# EasyEDA Pro project ProPrj_Project_PRISM_2026-03-07.epro, schematic PRISM RP2040

## Sheets
1 P1: Assembly Variant: Basic; Board Name: Board1; Create Date: 2026-01-16; Page Name: P1; Project Name: Project_PRISM; Schematic Name: Schematic1; Update Date: 2026-01-16; BladeWidth: 10; Page Size: A4; RegionStart: 1; ShowBorder: 1; TitleBlock: 1; TitleBlockPosition: 3; Version: 0; XRegionCount: 6; YRegionCount: 4
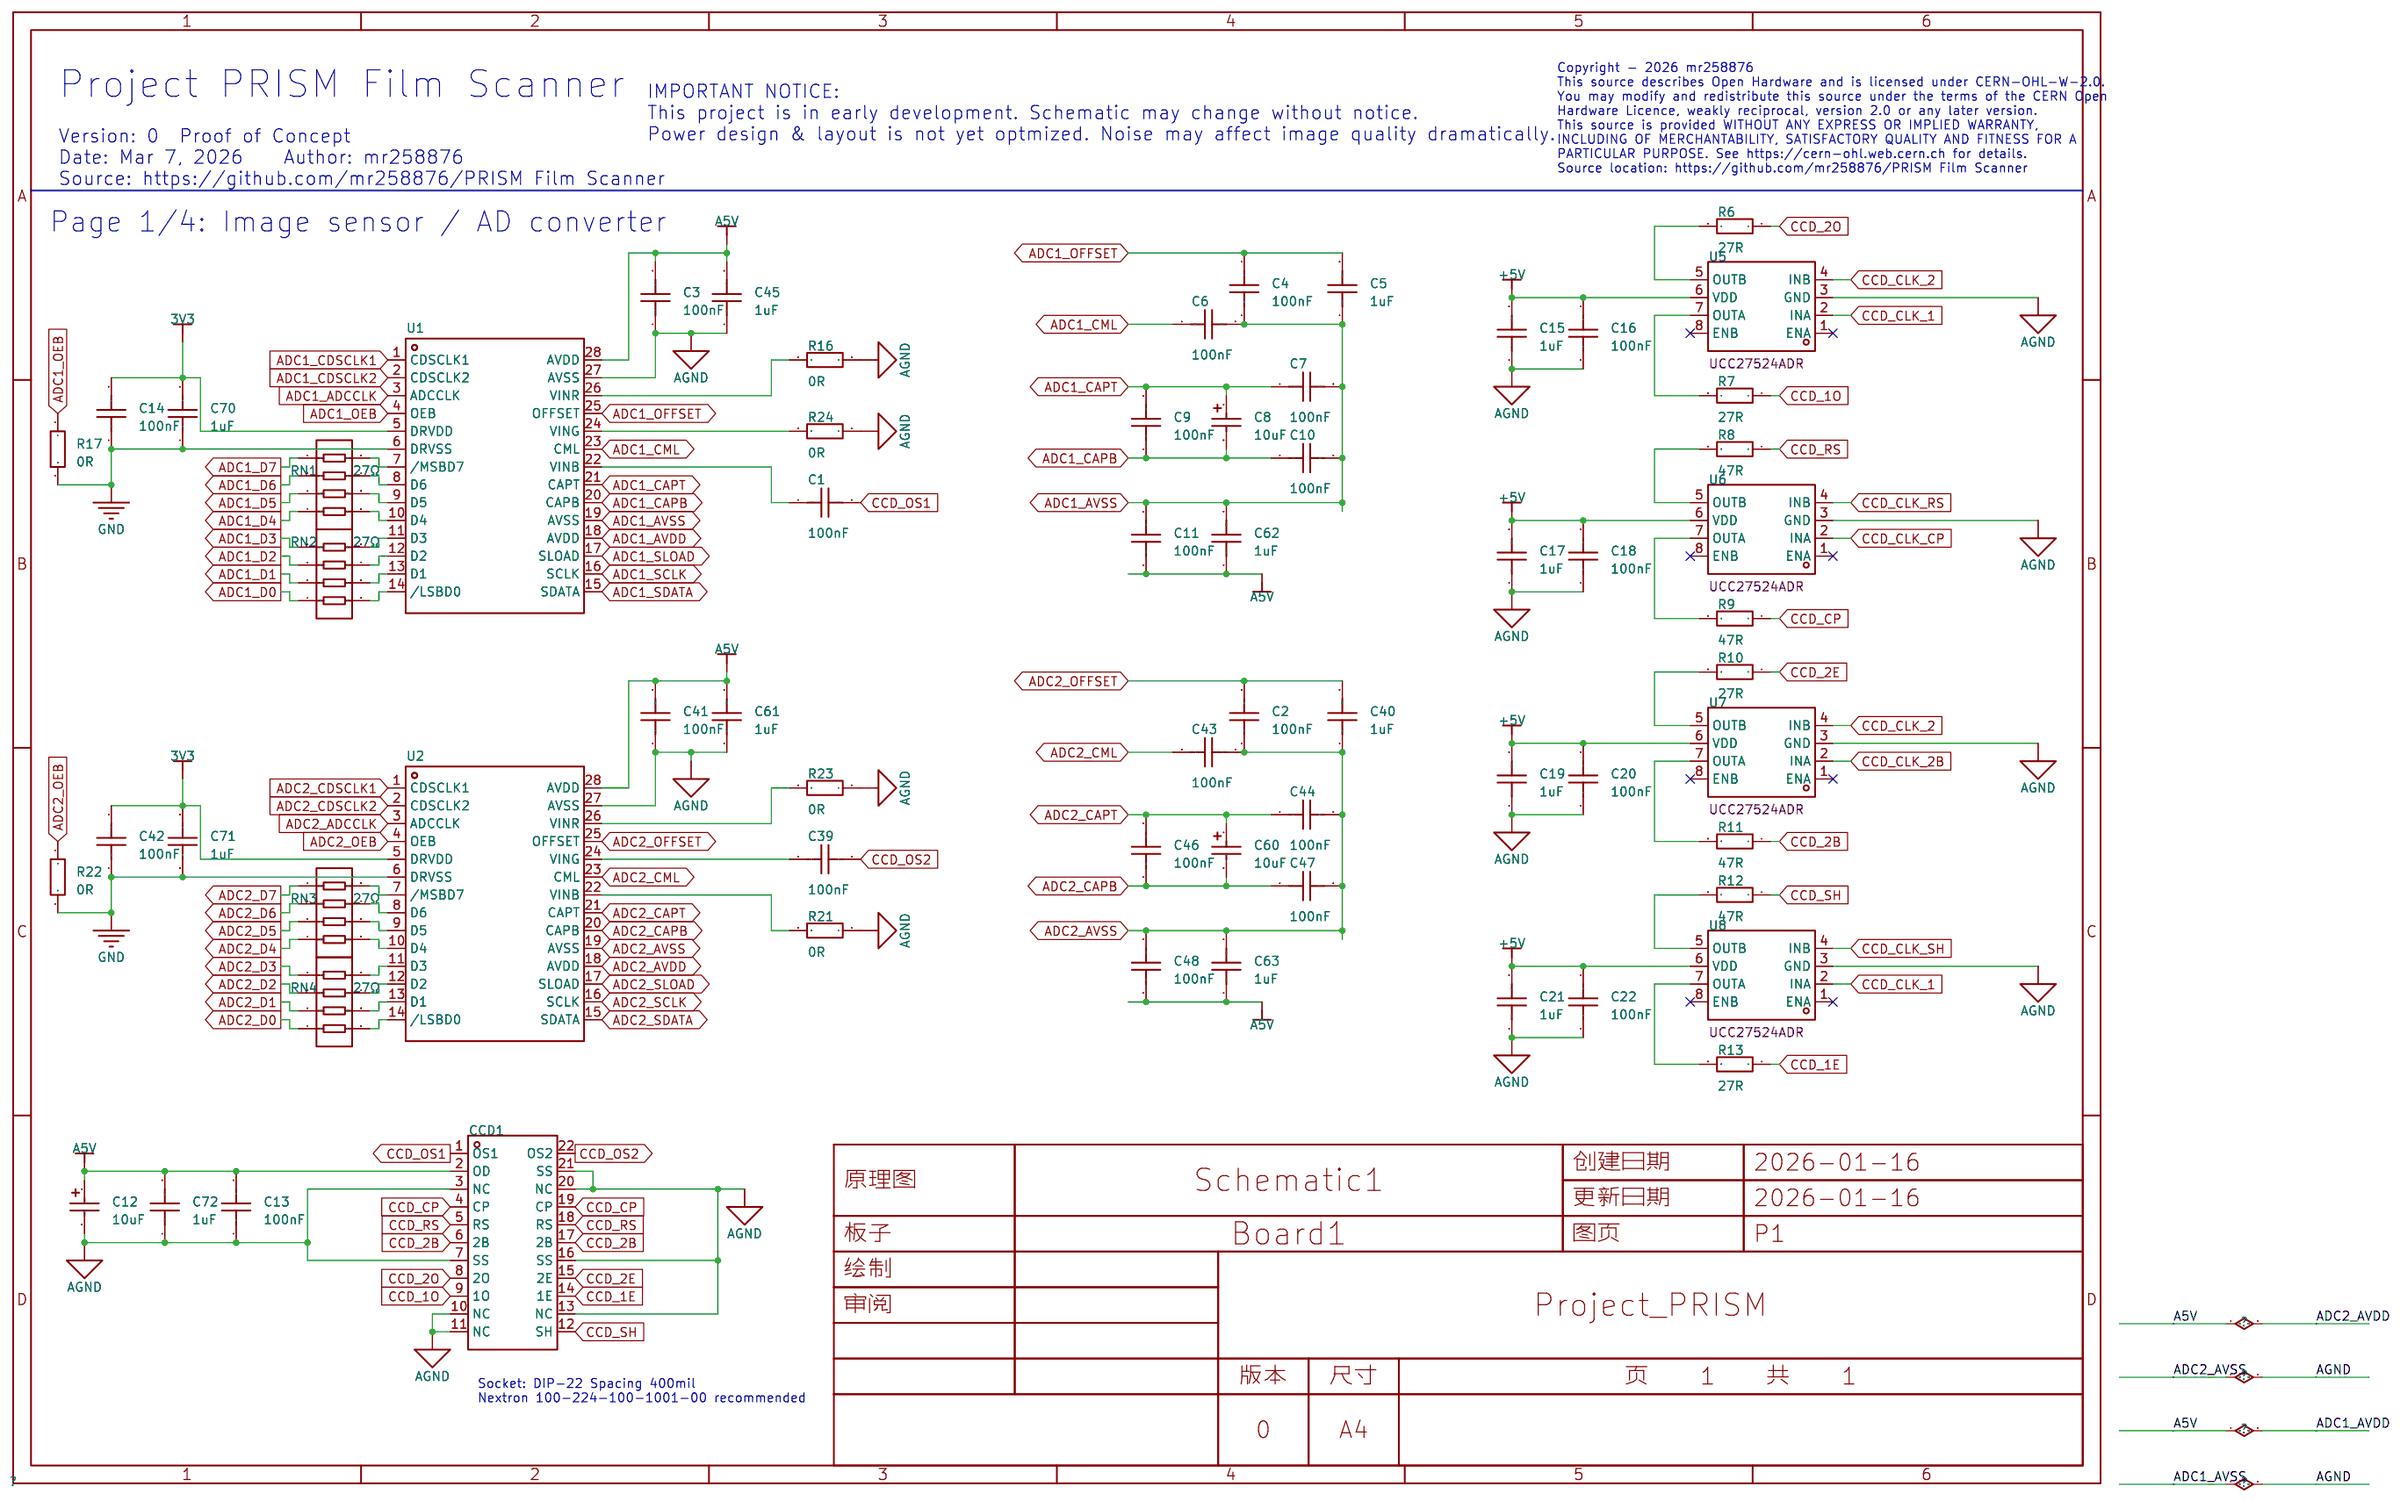
[diagram p0: P1]
2 P2: Page Name: P2
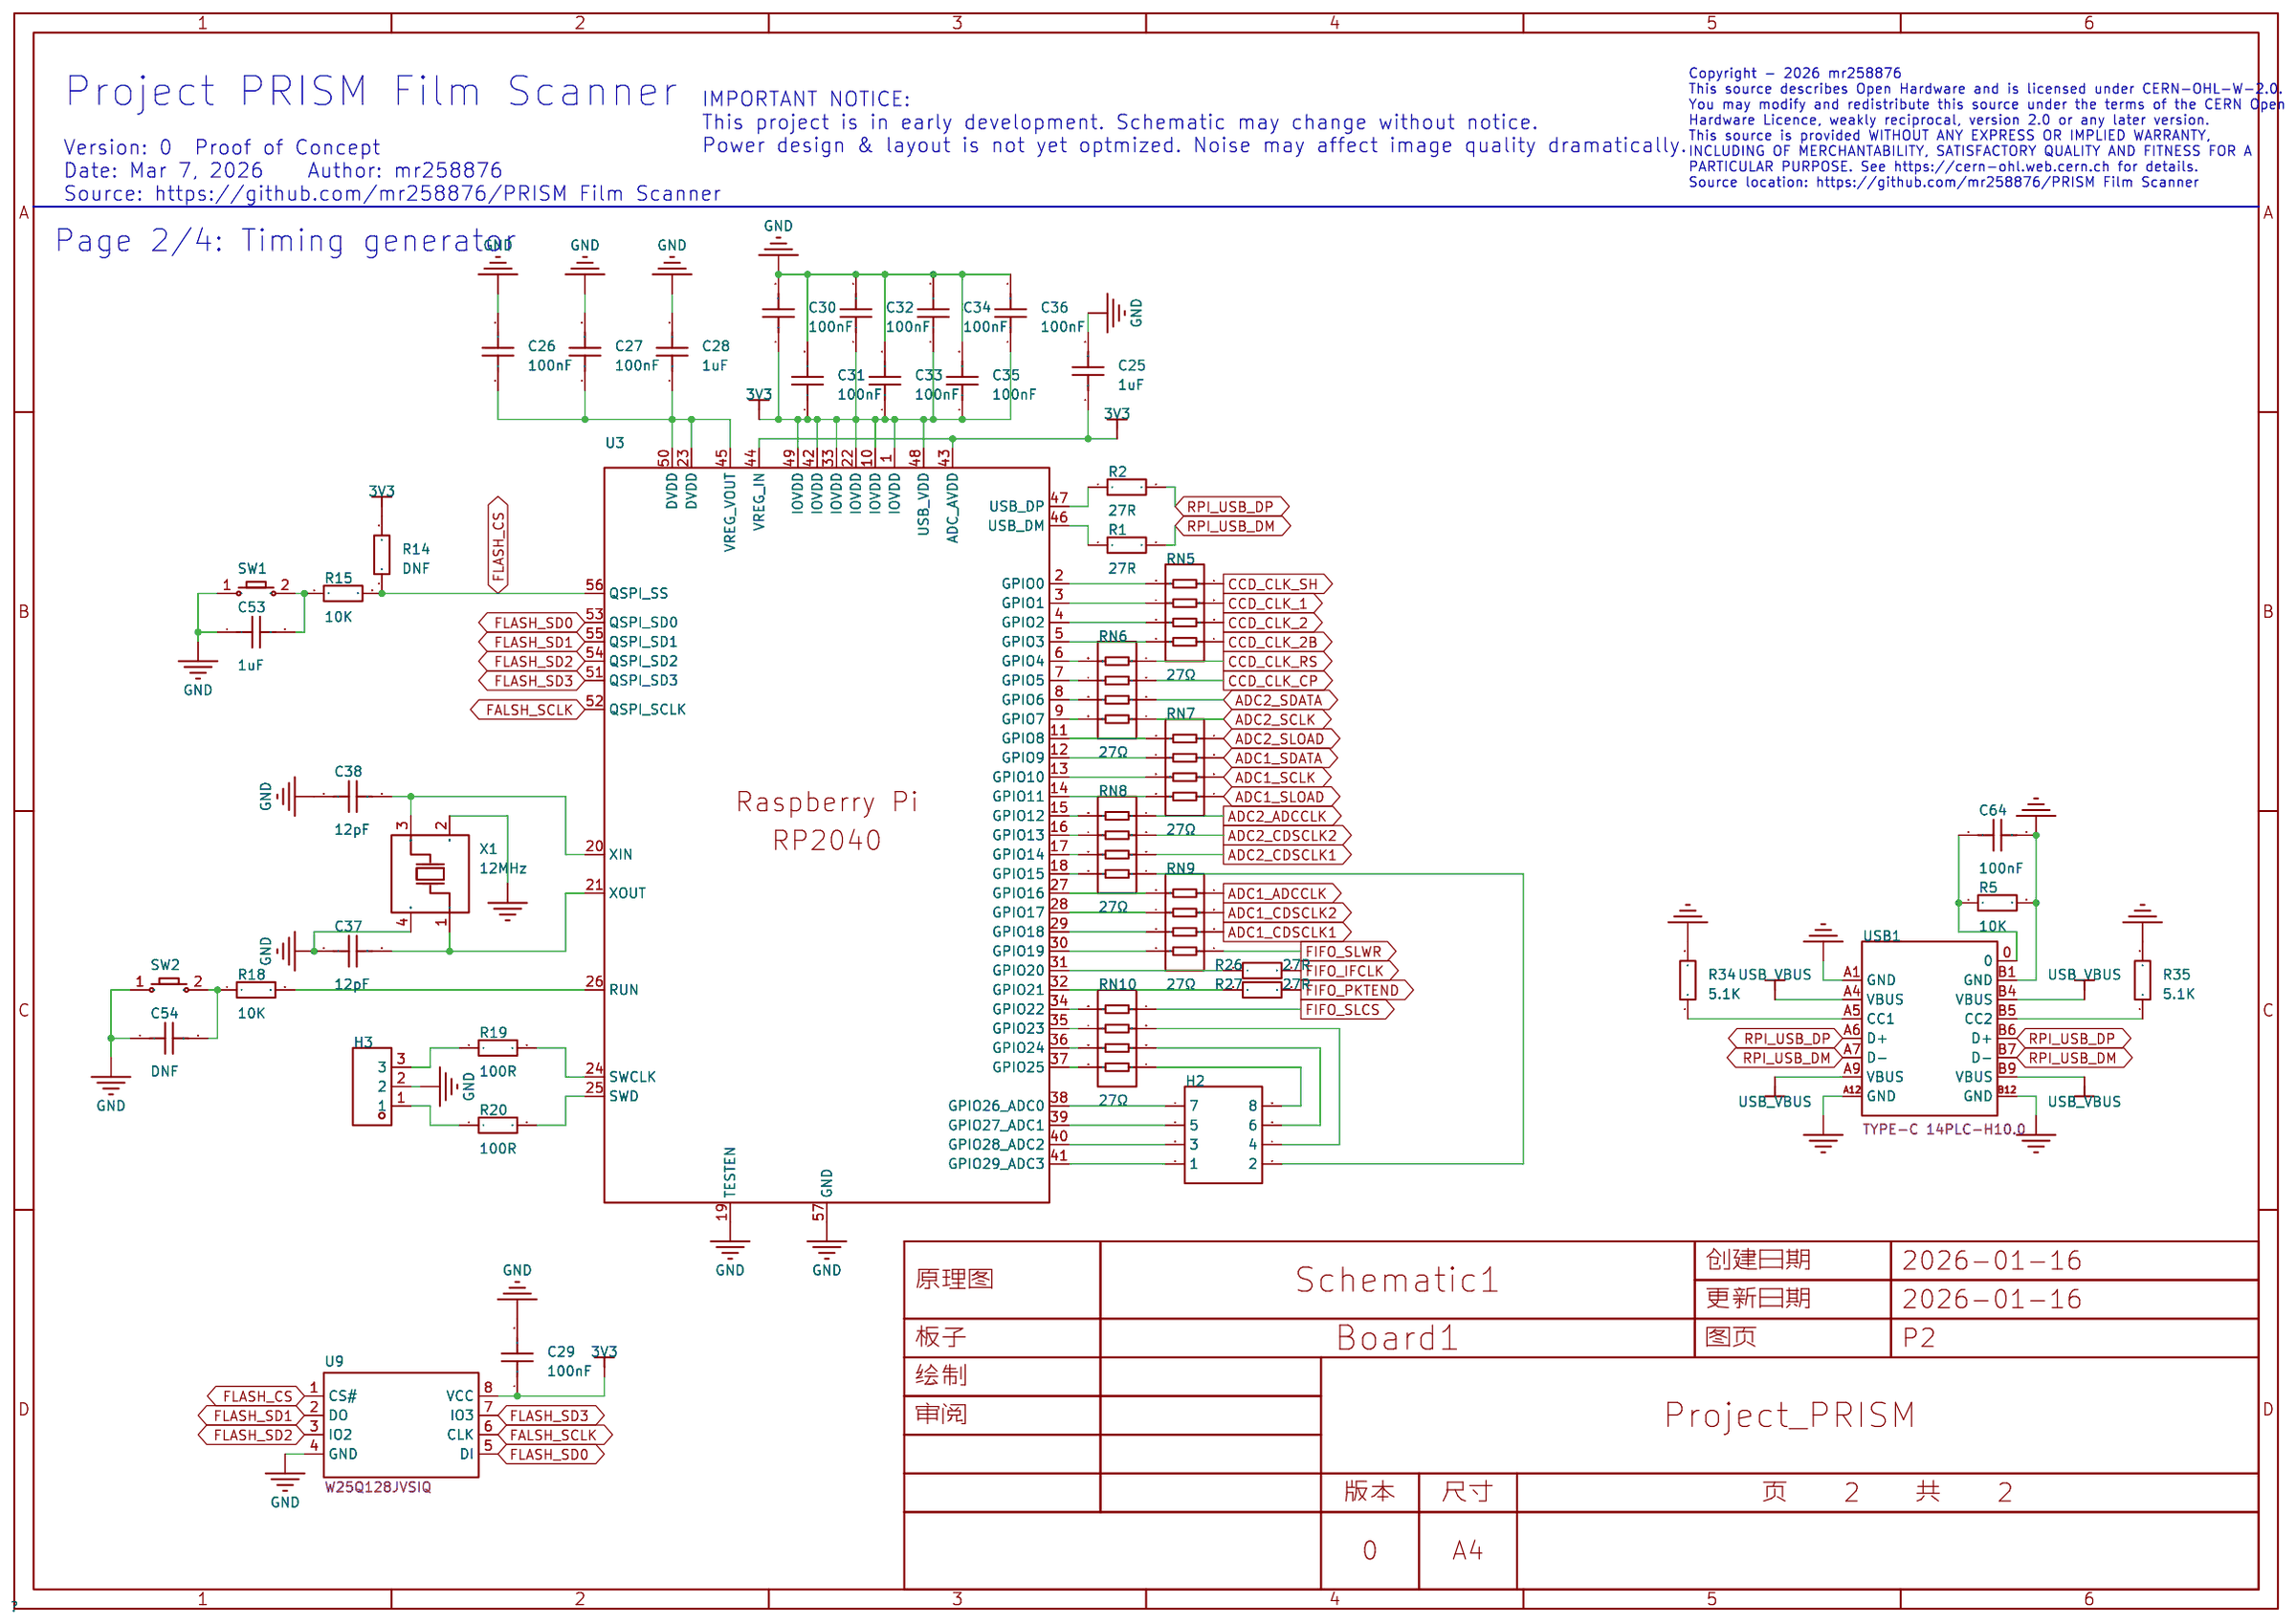
[diagram p1: P2]
3 P3: Board Name: PRISM RP2040; Create Date: 2026-01-30; Page Name: P3; Update Date: 2026-01-30
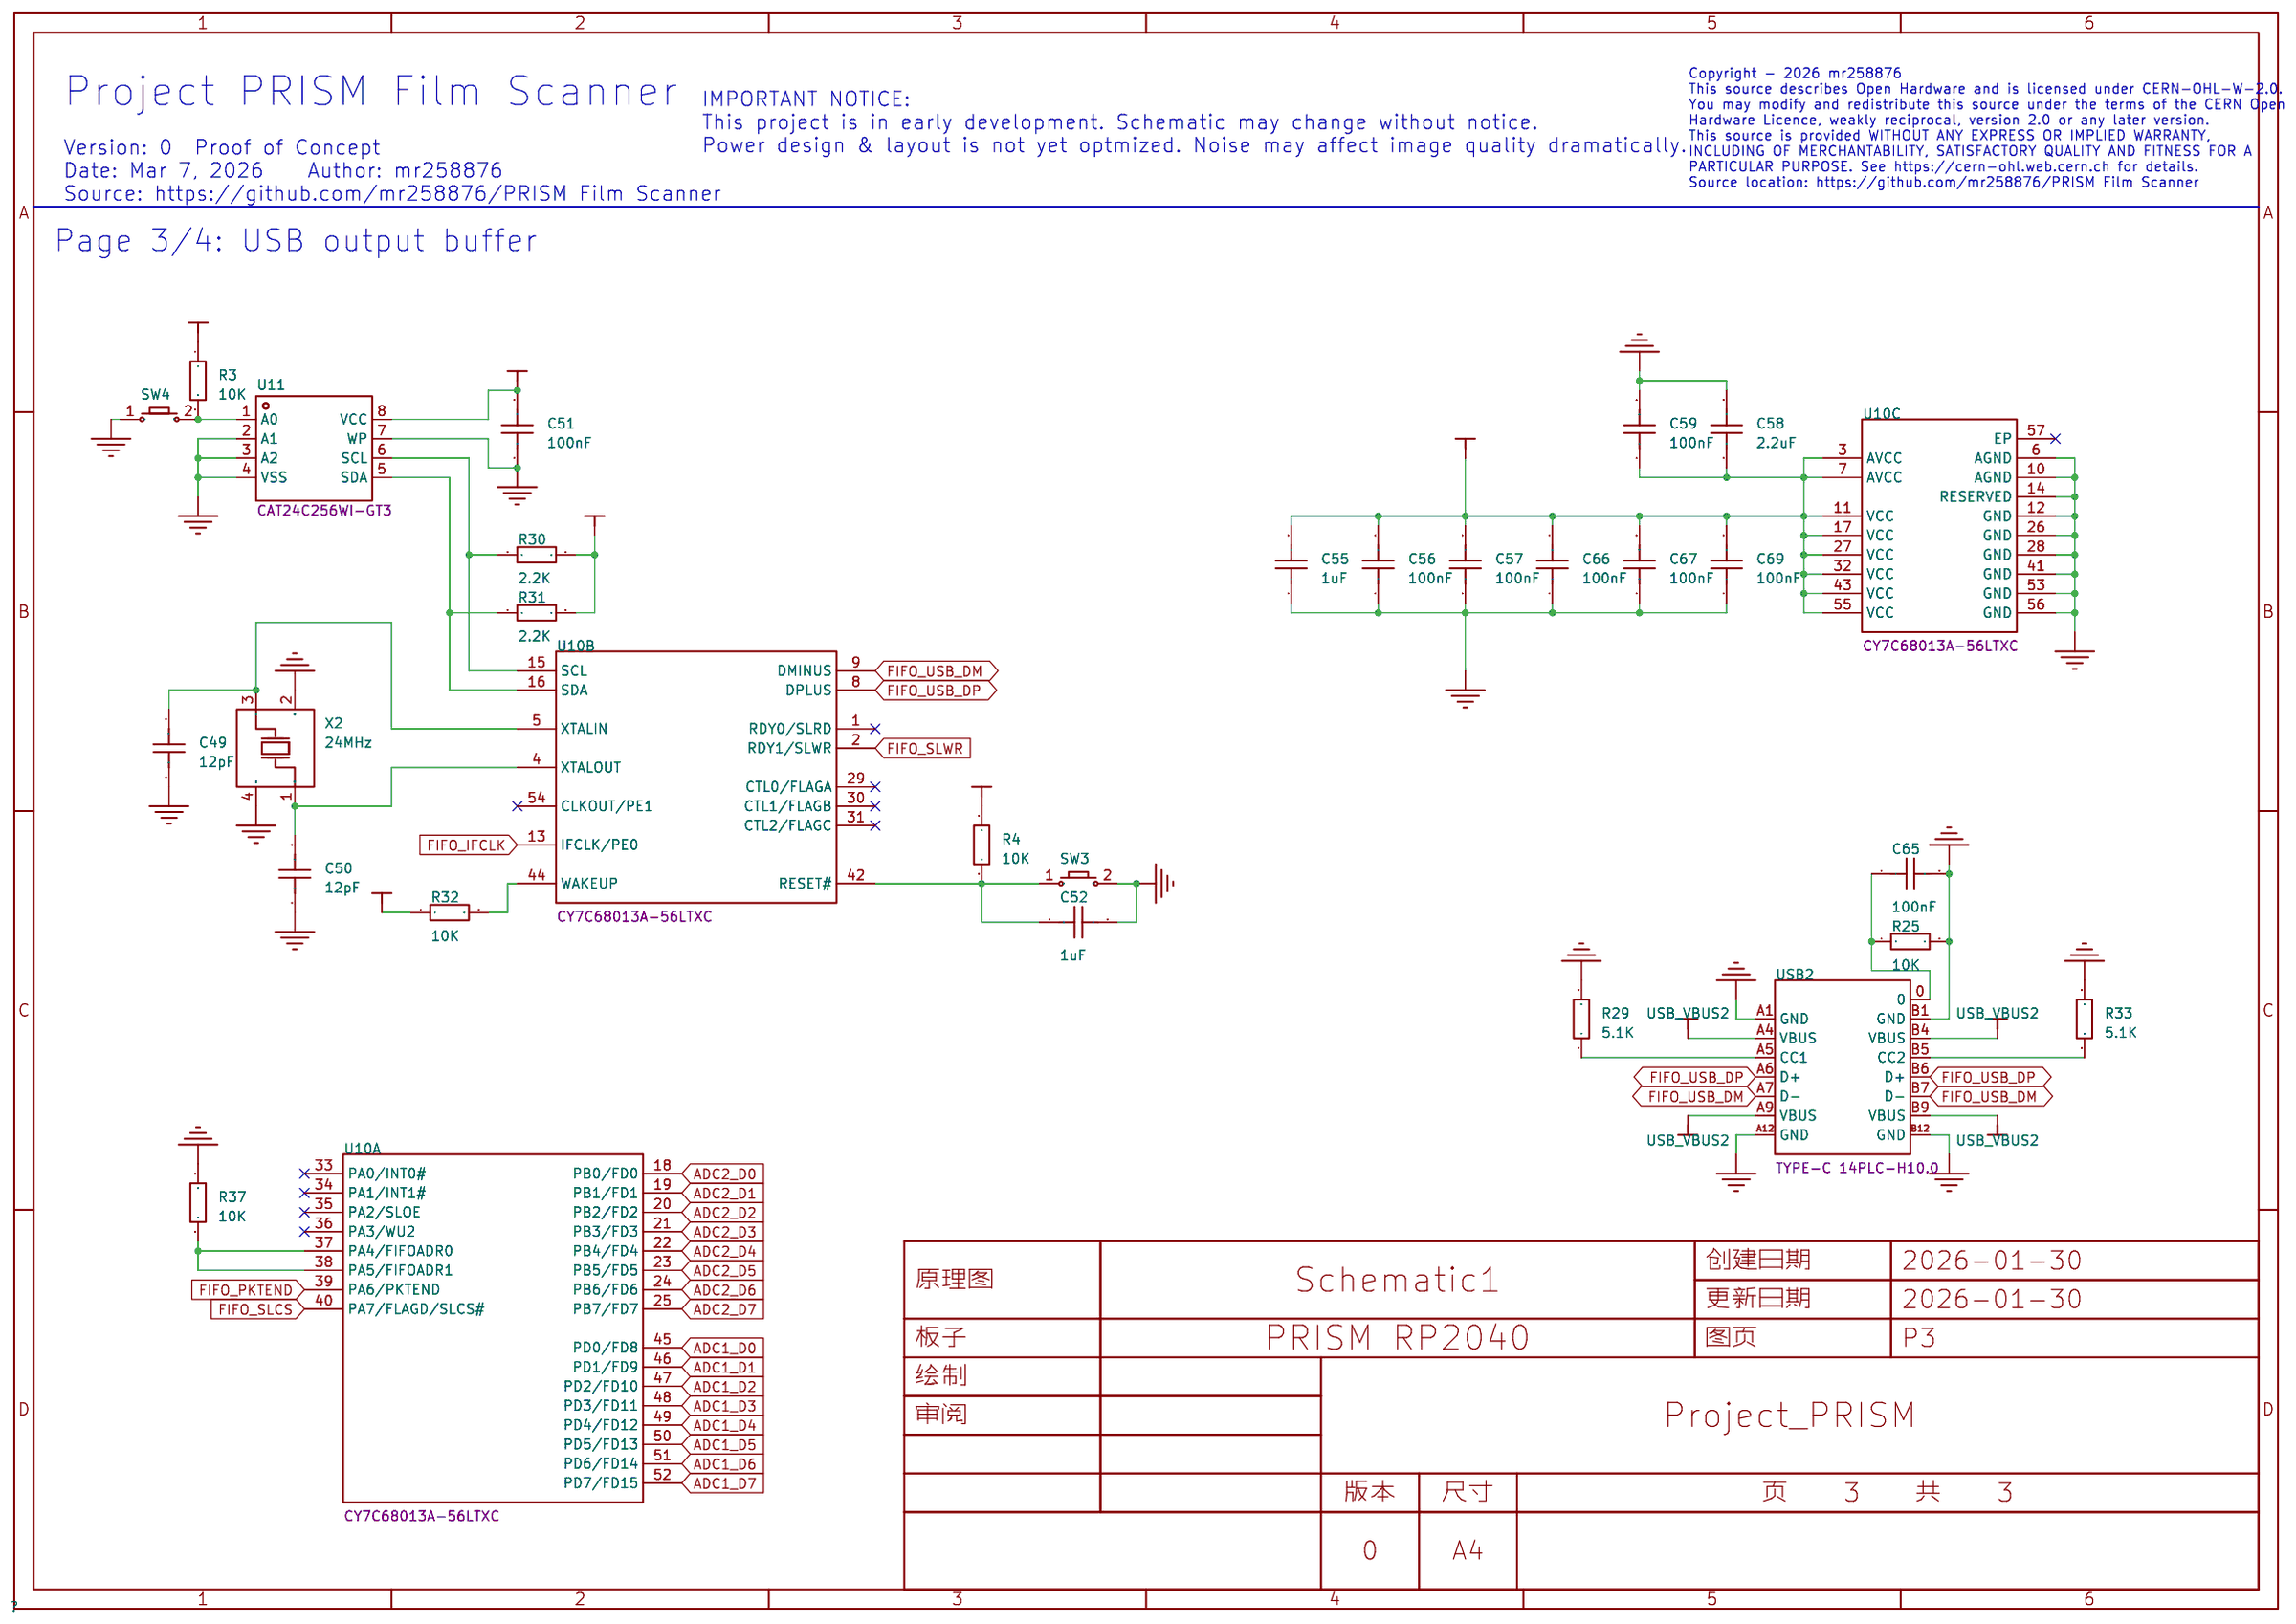
[diagram p2: P3]
4 P4: Board Name: PRISM RP2040; Create Date: 2026-01-30; Page Name: P4; Update Date: 2026-01-30
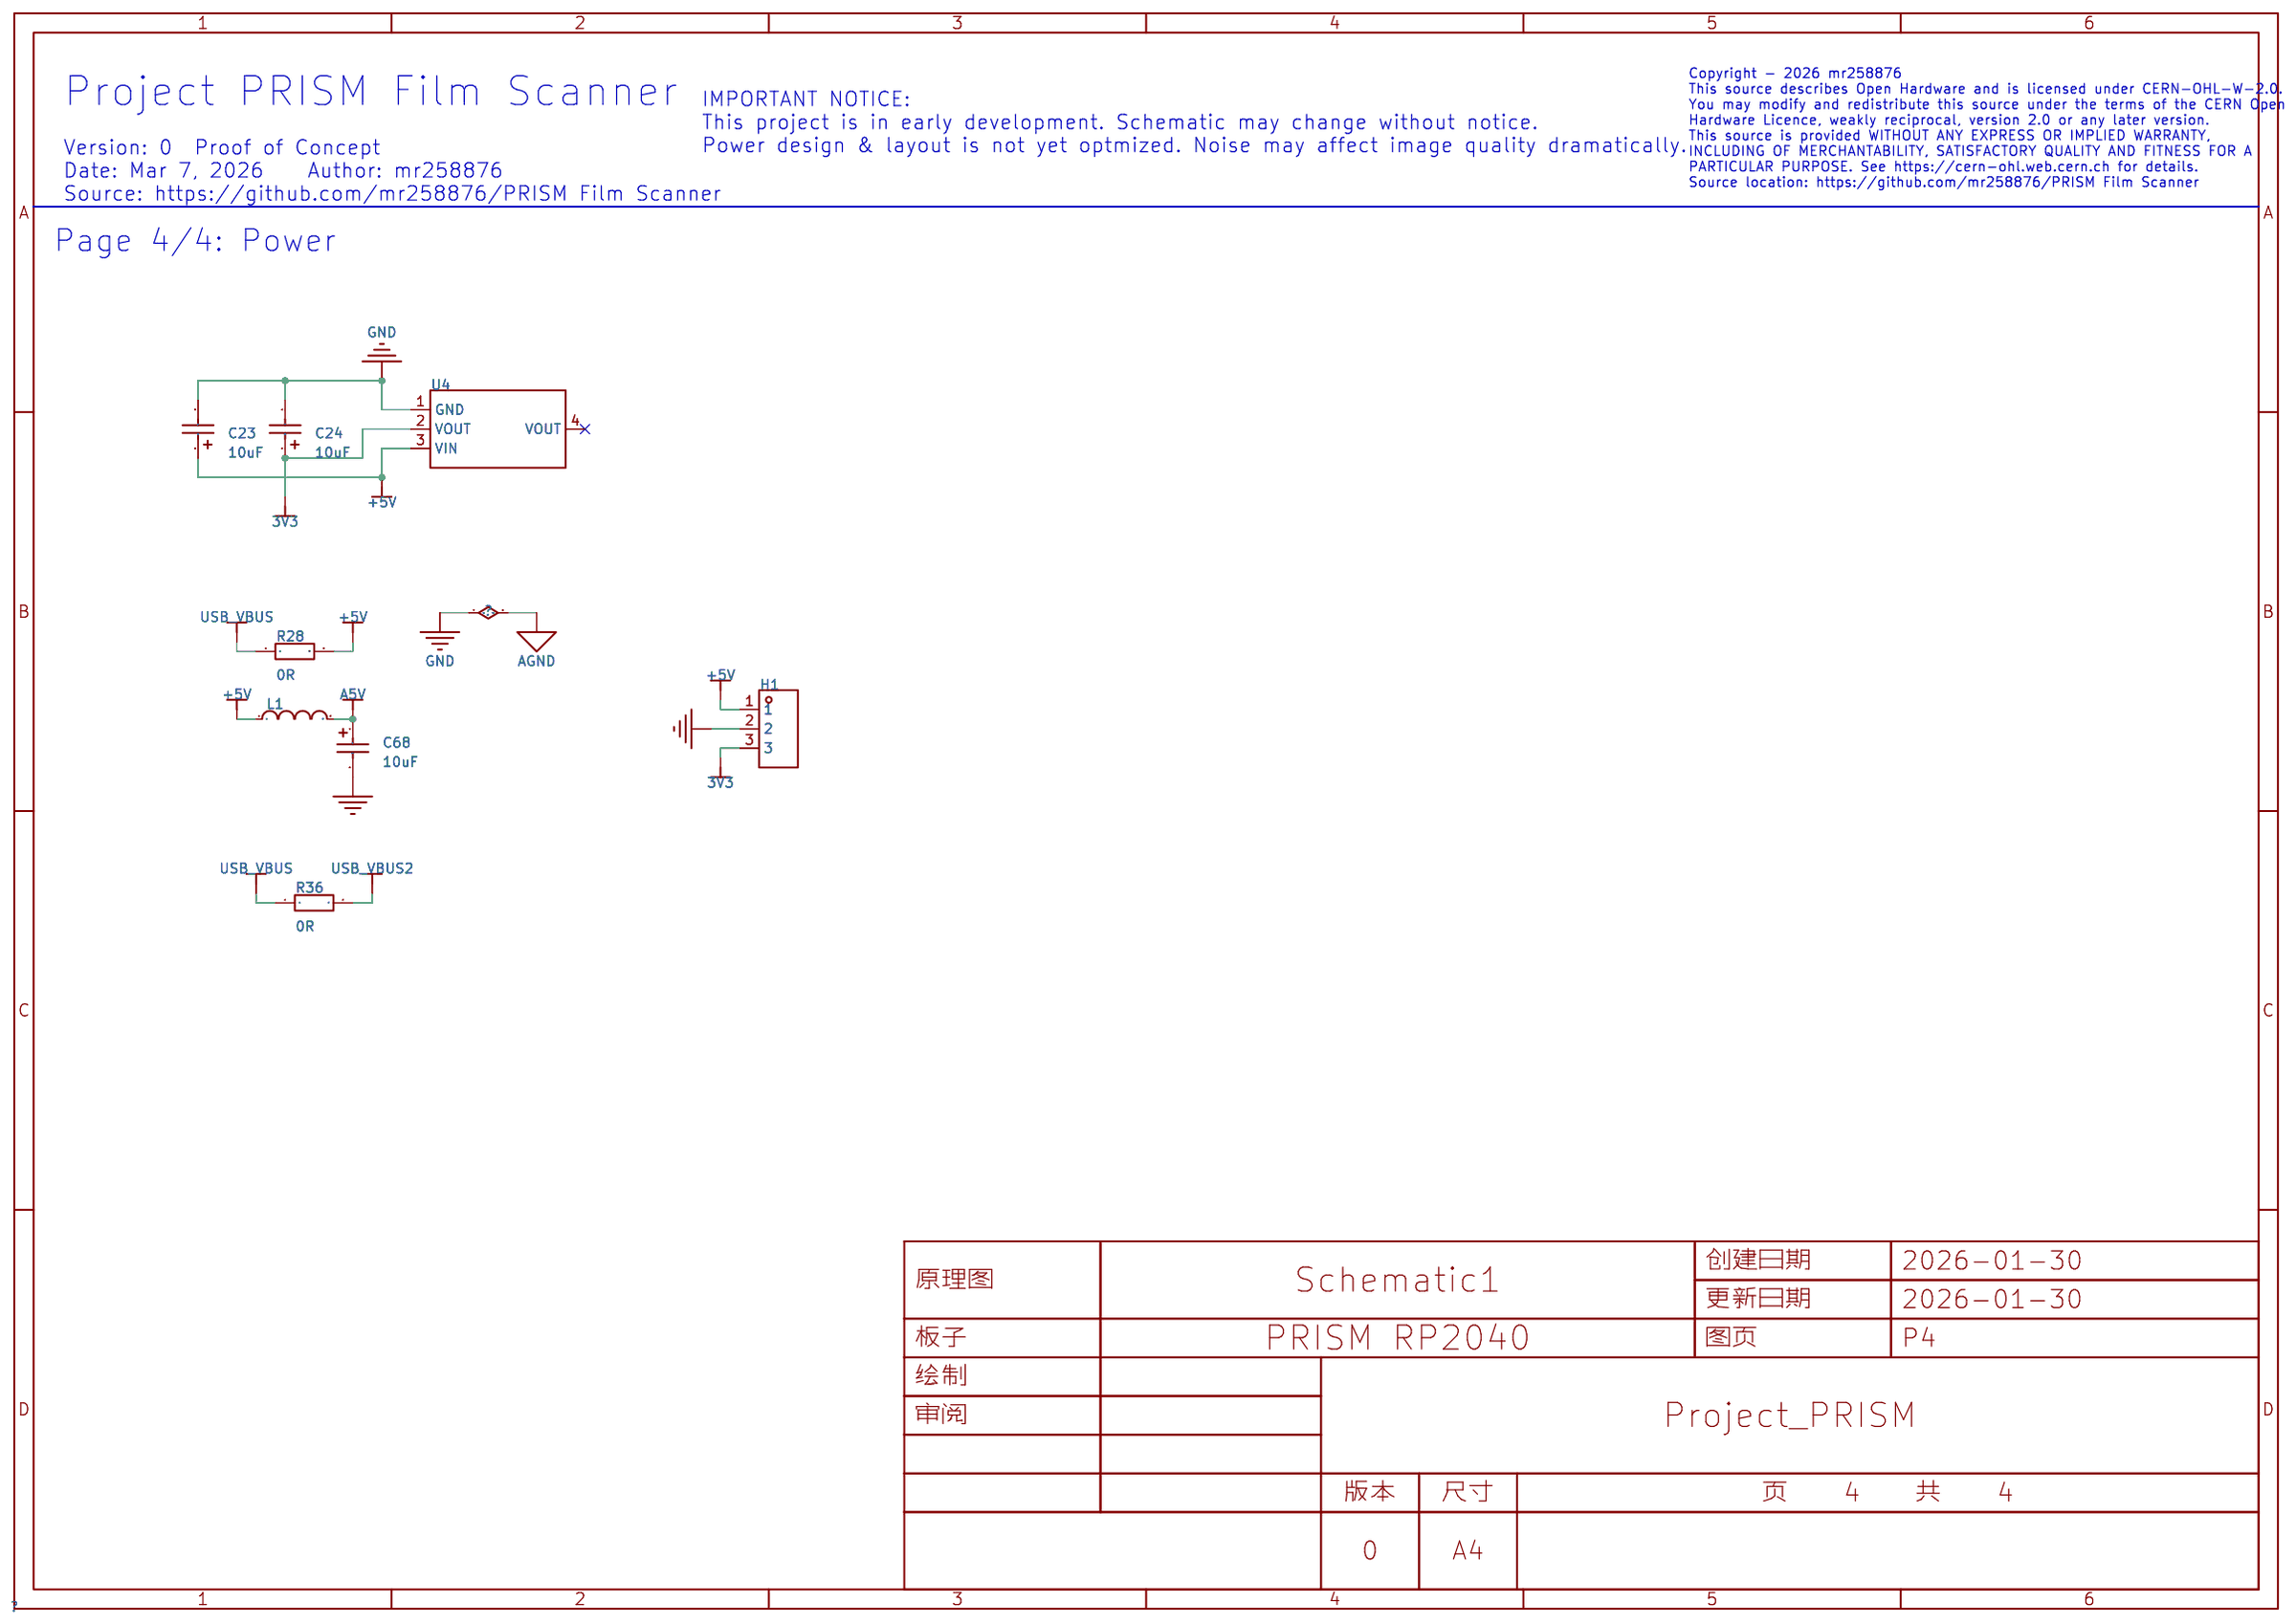
[diagram p3: P4]

## Parts
sheet P1
C1  100nF  [C0603]
C2  100nF  [C0603]
C3  100nF  [C0603]
C4  100nF  [C0603]
C5  1uF  [C0603]
C6  100nF  [C0603]
C7  100nF  [C0603]
C8  10uF  [CAP-SMD_L3.2-W1.6-RD-C7171]
C9  100nF  [C0603]
C10  100nF  [C0603]
C11  100nF  [C0603]
C12  10uF  [CAP-SMD_L3.2-W1.6-RD-C7171]
C13  100nF  [C0603]
C14  100nF  [C0603]
C15  1uF  [C0603]
C16  100nF  [C0603]
C17  1uF  [C0603]
C18  100nF  [C0603]
C19  1uF  [C0603]
C20  100nF  [C0603]
C21  1uF  [C0603]
C22  100nF  [C0603]
C39  100nF  [C0603]
C40  1uF  [C0603]
C41  100nF  [C0603]
C42  100nF  [C0603]
C43  100nF  [C0603]
C44  100nF  [C0603]
C45  1uF  [C0603]
C46  100nF  [C0603]
C47  100nF  [C0603]
C48  100nF  [C0603]
C60  10uF  [CAP-SMD_L3.2-W1.6-RD-C7171]
C61  1uF  [C0603]
C62  1uF  [C0603]
C63  1uF  [C0603]
C70  1uF  [C0603]
C71  1uF  [C0603]
C72  1uF  [C0603]
CCD1  -  [CDIP-22_L53.0-W9.7-P2.54-LS10.2-BL]
R6  27R  [R0603]
R7  27R  [R0603]
R8  47R  [R0603]
R9  47R  [R0603]
R10  27R  [R0603]
R11  47R  [R0603]
R12  47R  [R0603]
R13  27R  [R0603]
R16  0R  [R0603]
R17  0R  [R0603]
R21  0R  [R0603]
R22  0R  [R0603]
R23  0R  [R0603]
R24  0R  [R0603]
RN1  27Ω  [RES-ARRAY-SMD_0603-8P-L3.2-W1.6-BL]
RN2  27Ω  [RES-ARRAY-SMD_0603-8P-L3.2-W1.6-BL]
RN3  27Ω  [RES-ARRAY-SMD_0603-8P-L3.2-W1.6-BL]
RN4  27Ω  [RES-ARRAY-SMD_0603-8P-L3.2-W1.6-BL]
U1  AD9826KRSZRL  [SSOP-28_L10.2-W5.3-P0.65-LS7.8-BL]
U2  AD9826KRSZRL  [SSOP-28_L10.2-W5.3-P0.65-LS7.8-BL]
U5  UCC27524ADR  [SOIC-8_L4.9-W3.9-P1.27-LS6.0-BL]
U6  UCC27524ADR  [SOIC-8_L4.9-W3.9-P1.27-LS6.0-BL]
U7  UCC27524ADR  [SOIC-8_L4.9-W3.9-P1.27-LS6.0-BL]
U8  UCC27524ADR  [SOIC-8_L4.9-W3.9-P1.27-LS6.0-BL]
sheet P2
C25  1uF  [C0603]
C26  100nF  [C0603]
C27  100nF  [C0603]
C28  1uF  [C0603]
C29  100nF  [C0603]
C30  100nF  [C0603]
C31  100nF  [C0603]
C32  100nF  [C0603]
C33  100nF  [C0603]
C34  100nF  [C0603]
C35  100nF  [C0603]
C36  100nF  [C0603]
C37  12pF  [C0603]
C38  12pF  [C0603]
C53  1uF  [C0603]
C54  DNF  [C0603]
C64  100nF  [C0603]
H2  -  [HDR-TH_8P-P2.54-V-F-R2-C4-S2.54-1]
H3  -  [HDR-TH_3P-P2.54-V-M]
R1  27R  [R0603]
R2  27R  [R0603]
R5  10K  [R0603]
R14  DNF  [R0603]
R15  10K  [R0603]
R18  10K  [R0603]
R19  100R  [R0603]
R20  100R  [R0603]
R26  27R  [R0603]
R27  27R  [R0603]
R34  5.1K  [R0603]
R35  5.1K  [R0603]
RN5  27Ω  [RES-ARRAY-SMD_0603-8P-L3.2-W1.6-BL]
RN6  27Ω  [RES-ARRAY-SMD_0603-8P-L3.2-W1.6-BL]
RN7  27Ω  [RES-ARRAY-SMD_0603-8P-L3.2-W1.6-BL]
RN8  27Ω  [RES-ARRAY-SMD_0603-8P-L3.2-W1.6-BL]
RN9  27Ω  [RES-ARRAY-SMD_0603-8P-L3.2-W1.6-BL]
RN10  27Ω  [RES-ARRAY-SMD_0603-8P-L3.2-W1.6-BL]
SW1  -  [Key_SMD_3x4x2]
SW2  -  [Key_SMD_3x4x2]
U3  RP2040  [LQFN-56_L7.0-W7.0-P0.4-EP]
U9  W25Q128JVSIQ  [SOIC-8_L5.3-W5.3-P1.27-LS8.0-BL]
USB1  TYPE-C 14PLC-H10.0  [USB-C-TH_SHOUHAN_TYPE-C-14PLC-H10.0]
X1  12MHz  [CRYSTAL-SMD_4P-L3.2-W2.5-BL]
sheet P3
C49  12pF  [C0603]
C50  12pF  [C0603]
C51  100nF  [C0603]
C52  1uF  [C0603]
C55  1uF  [C0603]
C56  100nF  [C0603]
C57  100nF  [C0603]
C58  2.2uF  [C0603]
C59  100nF  [C0603]
C65  100nF  [C0603]
C66  100nF  [C0603]
C67  100nF  [C0603]
C69  100nF  [C0603]
R3  10K  [R0603]
R4  10K  [R0603]
R25  10K  [R0603]
R29  5.1K  [R0603]
R30  2.2K  [R0603]
R31  2.2K  [R0603]
R32  10K  [R0603]
R33  5.1K  [R0603]
R37  10K  [R0603]
SW3  -  [Key_SMD_3x4x2]
SW4  -  [Key_SMD_3x4x2]
U10  CY7C68013A-56LTXC  [QFN-56_L8.0-W8.0-P0.50-BL-EP6.1]  (sections 1,2,3)
U11  CAT24C256WI-GT3  [SOIC-8_L4.9-W3.9-P1.27-LS6.0-BL]
USB2  TYPE-C 14PLC-H10.0  [USB-C-TH_SHOUHAN_TYPE-C-14PLC-H10.0]
X2  24MHz  [CRYSTAL-SMD_4P-L3.2-W2.5-BL]
sheet P4
C23  10uF  [CAP-SMD_L3.2-W1.6-RD-C7171]
C24  10uF  [CAP-SMD_L3.2-W1.6-RD-C7171]
C68  10uF  [CAP-SMD_L3.2-W1.6-RD-C7171]
H1  -  [HDR-TH_3P-P2.54-V-M]
L1  BLM18PG121SN1D  [L0603]
R28  0R  [R1206]
R36  0R  [R1206]
U4  AMS1117-3.3  [SOT-223-3_L6.5-W3.4-P2.30-LS7.0-BR]

## Library data of the parts
C1-C7 C9-C11 C13-C22 C25-C59 C61-C67 C69-C72 = CAP_0603: Supplier Footprint: 0603
C8 C12 C23 C24 C60 C68 = TAJA106K016RNJ: 容值:10uF;精度:±10%;额定电压:16V;等效串联电阻(ESR):3Ω@100kHz;; LCSC Part Name: 10uF ±10% 16V; Supplier Part: C7171; Manufacturer: Kyocera AVX; Supplier Footprint: CASE-A-3216-18(mm); JLCPCB Part Class: Basic Part; Supplier: LCSC; Tolerance: ±10%; Voltage Rating: 16V; Equivalent Series Resistance(ESR): 3Ω@100kHz; Operating Temperature: -55℃~+125℃
CCD1 = TCD1708D: 传感器类型:CCD图像传感器;像素大小:8umx200um;; LCSC Part Name: CCD线性图像传感器; Supplier Part: C2846069; Manufacturer: TOSHIBA(东芝); Supplier Footprint: CDIP-22; Sensor Type: CCD图像传感器; Pixel Size: 4.7umx4.7um; Operating Temperature: -25℃~+60℃
R1-R27 R29-R35 R37 = Res_0603: Supplier Footprint: 0603
RN1-RN10 = 4D03WGF270JT5E: 电阻器数:4;阻值:27Ω;精度:±1%;单个元件功率:62.5mW;温度系数:±200ppm/℃;; LCSC Part Name: 27Ω ±1%; Supplier Part: C425222; Manufacturer: UNI-ROYAL(厚声); Supplier Footprint: 0603x4; JLCPCB Part Class: Extended Part; Datasheet: https://atta.szlcsc.com/upload/public/pdf/source/20191224/C474318_2527498AE30E813171187CCD28401A71.pdf; Supplier: LCSC; Number of Resistors: 4; Tolerance: ±1%; Power(Watts): 62.5mW; Temperature Coefficient: ±200ppm/℃; Number of Pins: 8
U1 U2 = AD9826KRSZRL: 分辨率:16位;采样率:15MHz;工作电压:4.75V~5.25V;接口类型:串行;; LCSC Part Name: 完整的16位成像信号处理器; Supplier Part: C13734; Manufacturer: ADI(亚德诺); Supplier Footprint: SSOP-28-208mil; JLCPCB Part Class: Extended Part; Datasheet: https://item.szlcsc.com/datasheet/AD9826KRSZRL/14389.html; Supplier: LCSC; Resolution(Bits): 16位; Sampling Rate: 15MHz; number of channels: 3; Voltage - Supply: 4.75V~5.25V; Interface: 串行; Integral non - linearity: 0.5LSB; Operating Temperature: -40℃~+85℃
U5-U8 = UCC27524ADR: 驱动配置:低边;负载类型:IGBT；MOSFET;驱动通道数:2;灌电流(IOL):5A;拉电流(IOH):5A;工作电压:4.5V~18V;上升时间(tr):7ns;下降时间(tf):9ns;; LCSC Part Name: 具备负输入电压能力的双路5A高速低侧栅极驱动器; Supplier Part: C185857; Manufacturer: TI(德州仪器); Supplier Footprint: SOIC-8; JLCPCB Part Class: Extended Part; Datasheet: https://www.ti.com/cn/lit/gpn/ucc27524a; Supplier: LCSC; Driven Configuration: 低边; Load Type: IGBT；MOSFET; Number of Drivers: 2; Current - Output Low(IOL): 5A; Current - Output High(IOH): 5A; Voltage - Supply: 4.5V~18V; Rise Time: 7ns; Fall Time: 9ns; Features: 欠压保护(UVP); Operating Temperature: -40℃~+140℃; Input Logic Level - High: 1.9V~2.3V; Input Logic Level - Low: 1V~1.4V
H2 = HDR-F_2.54_2x4: Supplier Part: C92271; Supplier Footprint: 插件
H1 H3 = HDR-M_2.54_1x3P: Supplier Part: C2937625; Supplier Footprint: 插件
SW1-SW4 = Key_SMD_3x4x2: Supplier Footprint: SMD
U3 = RP2040_C2040: CPU内核:-;CPU最大主频:133MHz;; LCSC Part Name: RP2040（RP2B2）; Supplier Part: C2040; Manufacturer: Raspberry Pi(树莓派); Supplier Footprint: LQFN-56(7x7); JLCPCB Part Class: Extended Part; Datasheet: https://item.szlcsc.com/datasheet/RP2040/2392.html; Supplier: LCSC; CPU Maximum Speed: 133MHz; Number of I/O: 30; ADC (Bit): 12bit
U9 = W25Q128JVSIQ: 接口类型:SPI;存储容量:128Mbit;时钟频率(fc):133MHz;; LCSC Part Name: 编带 支持双路/四路SPI接口的3V、128Mbit 串行闪存; Supplier Part: C97521; Manufacturer: Winbond(华邦); Supplier Footprint: SOIC-8-208mil; JLCPCB Part Class: Basic Part; Datasheet: https://item.szlcsc.com/datasheet/W25Q128JVSIQ/98729.html; Supplier: LCSC; Interface: SPI; Memory Size: 128Mbit; Clock Frequency: 133MHz; Voltage - Supply: 2.7V~3.6V; Standby Supply Current: 1uA; Program / Erase Cycles: 100000次; Page Programming Time (Tpp): 3ms; Block Erase Time(tBE): 120ms@(32KB); Data Retention - TDR (Year): 20年; Operating Temperature: -40℃~+85℃
USB1 USB2 = TYPE-C 14PLC-H10.0: 连接器类型:Type-C;协议标准:USB 3.1;公母:母;安装方式:直插;触点数量:14P;端口数量:1;额定电流 - 电源:5A;工作温度:-40℃~+85℃;; LCSC Part Name: 14P直插母座; Supplier Part: C3151746; Manufacturer: SHOU HAN(首韩); Supplier Footprint: 插件; JLCPCB Part Class: Extended Part; Datasheet: https://item.szlcsc.com/datasheet/TYPE-C%252014PLC-H10.0/3712564.html; Supplier: LCSC; Connector Type: Type-C; Protocol Standard: USB 3.1; Gender: 母; Mounting Type: 直插; Number of Contacts: 14P; Number of Ports: 1; Current Rating-Power: 5A; Voltage Rating: 20V; Connect-Disconnect Life: 1万次; Detection color: 黑色; Operating Temperature: -40℃~+85℃
X1 = X322512MSB4SI: 晶振类型:贴片晶振;频率:12MHz;常温频差:±10ppm;负载电容:20pF;频率稳定度:±20ppm;; LCSC Part Name: YSX321SL 12MHZ 4P 3225 20PF ±10PPM -40~85℃ (±20PPM); Supplier Part: C9002; Manufacturer: YXC(扬兴晶振); Supplier Footprint: SMD3225-4P; JLCPCB Part Class: Basic Part; Datasheet: https://item.szlcsc.com/datasheet/X322512MSB4SI/9522.html; Supplier: LCSC; Type: 贴片晶振; Normal temperature Frequency Tolerance: ±10ppm; Load Capacitance: 20pF; Frequency Stability: ±20ppm; Operating Temperature: -40℃~+85℃
U10 = CY7C68013A-56LTXC_C14912: CPU内核:51系列;CPU最大主频:48MHz;应用领域:-;; LCSC Part Name: EZ-USB FX2LP USB微控制器，高速USB外设控制器; Supplier Part: C14912; Manufacturer: Infineon/CYPRESS(赛普拉斯); Supplier Footprint: QFN-56-EP(8x8); JLCPCB Part Class: Extended Part; Datasheet: https://item.szlcsc.com/datasheet/CY7C68013A-56LTXC/15584.html; Supplier: LCSC; CPU Core: 51系列; CPU Maximum Speed: 48MHz; Program Memory Type: FLASH; Number of I/O: 24; Voltage - Supply: 3V~3.6V
U11 = CAT24C256WI-GT3: 接口类型:I2C;存储容量:256Kbit;时钟频率(fc):1MHz;; Supplier Part: C79987; Manufacturer: onsemi(安森美); Supplier Footprint: SOIC-8; JLCPCB Part Class: Extended Part; Datasheet: https://item.szlcsc.com/datasheet/CAT24C256WI-GT3/81132.html; Supplier: LCSC; Interface: I2C; Memory Size: 256Kbit; Clock Frequency: 1MHz; Voltage - Supply: 1.8V~5.5V; Write Cycle Time(Tw): 5ms; Data Retention - TDR (Year): 100年; Write Cycle Endurance: 100万次; Operating Temperature: -40℃~+85℃
X2 = X322524MOB4SI: 晶振类型:贴片晶振;频率:24MHz;常温频差:±10ppm;负载电容:12pF;频率稳定度:±20ppm;; LCSC Part Name: YSX321SL 24MHZ 4P 3225 12PF ±10PPM -40~85℃ (±20PPM); Supplier Part: C70590; Manufacturer: YXC(扬兴晶振); Supplier Footprint: SMD3225-4P; JLCPCB Part Class: Extended Part; Datasheet: https://item.szlcsc.com/datasheet/X322524MOB4SI/71688.html; Supplier: LCSC; Type: 贴片晶振; Normal temperature Frequency Tolerance: ±10ppm; Load Capacitance: 12pF; Frequency Stability: ±20ppm; Operating Temperature: -40℃~+85℃
L1 = BLM18PG121SN1D: 阻抗@频率:120Ω@100MHz;误差:±25%;直流电阻(DCR):50mΩ;; LCSC Part Name: 单路 0603磁珠 阻抗120Ω@100MHz; Supplier Part: C14709; Manufacturer: muRata(村田); Supplier Footprint: 0603; JLCPCB Part Class: Basic Part; Datasheet: https://item.szlcsc.com/datasheet/BLM18PG121SN1D/15379.html; Supplier: LCSC; Impedance @ Frequency: 120Ω@100MHz; Tolerance: ±25%; DC Resistance(DCR): 50mΩ; Current Rating: 2A; Number of Circuits: 1; Operating Temperature: -55℃~+125℃
R28 R36 = Res_1206: Supplier Footprint: 1206
U4 = AMS1117-3.3_C6186: 输出类型:固定;工作电压:16V;输出电压:3.3V;输出电流:1A;电源纹波抑制比(PSRR):72dB@(120Hz);输出极性:正极;; LCSC Part Name: 输出3.3V 1A; Supplier Part: C6186; Manufacturer: AMS; Supplier Footprint: SOT-223; JLCPCB Part Class: Basic Part; Datasheet: https://item.szlcsc.com/datasheet/AMS1117-3.3/6652.html; Supplier: LCSC; Output Type: 固定; Voltage - Supply: 16V; Output Voltage: 3.3V; Output Current: 1A; Power Supply Rejection Ratio (PSRR): 72dB@(120Hz); Voltage Dropout: 1.1V@(800mA); standby current: 5mA; Noise: 0.003%Vout; Features: 过流保护；过热保护; Operating Temperature: -40℃~+125℃; Output Configuration: 正极; Number of Outputs: 1

## Nets
3V3: C14.2 C24.1 C25.1 C29.1 C30.1 C31.1 C32.1 C33.1 C34.1 C35.1 C36.1 C42.2 C51.2 C55.2 C56.2 C57.2 C58.1 C59.1 C66.2 C67.2 C69.2 C70.2 C71.2 H1.3 R3.1 R4.1 R14.2 R30.2 R31.2 R32.1 U1.5(DRVDD) U2.5(DRVDD) U3.1(IOVDD) U3.10(IOVDD) U3.22(IOVDD) U3.33(IOVDD) U3.42(IOVDD) U3.43(ADC_AVDD) U3.44(VREG_IN) U3.48(USB_VDD) U3.49(IOVDD) U4.2(VOUT) U9.8(VCC) U10.3(AVCC) U10.7(AVCC) U10.11(VCC) U10.17(VCC) U10.27(VCC) U10.32(VCC) U10.43(VCC) U10.55(VCC) U11.8(VCC)
+5V: C15.2 C16.2 C17.2 C18.2 C19.2 C20.2 C21.2 C22.2 C23.1 H1.1 L1.1 R28.2 U4.3(VIN) U5.6(VDD) U6.6(VDD) U7.6(VDD) U8.6(VDD)
A5V: C3.2 C11.1 C12.1 C13.2 C41.2 C45.2 C48.1 C61.2 C62.1 C63.1 C68.1 C72.2 CCD1.2(OD) L1.2 U1.18(AVDD) U1.28(AVDD) U2.18(AVDD) U2.28(AVDD)
AGND: C2.1 C3.1 C4.1 C5.1 C6.2 C7.2 C10.2 C11.2 C12.2 C13.1 C14.1 C15.1 C16.1 C17.1 C18.1 C19.1 C20.1 C21.1 C22.1 C23.2 C24.2 C25.2 C26.2 C27.2 C28.2 C29.2 C30.2 C31.2 C32.2 C33.2 C34.2 C35.2 C36.2 C37.1 C38.1 C40.1 C41.1 C42.1 C43.2 C44.2 C45.1 C47.2 C48.2 C49.1 C50.1 C51.1 C52.2 C53.1 C54.1 C55.1 C56.1 C57.1 C58.2 C59.2 C61.1 C62.2 C63.2 C64.2 C65.2 C66.1 C67.1 C68.2 C69.1 C70.1 C71.1 C72.1 CCD1.3(NC) CCD1.7(SS) CCD1.10(NC) CCD1.11(NC) CCD1.13(NC) CCD1.16(SS) CCD1.20(NC) CCD1.21(SS) H1.2 H3.2 R5.2 R16.1 R17.2 R21.1 R22.2 R23.1 R24.1 R25.2 R29.2 R33.1 R34.2 R35.2 R37.2 SW1.1 SW2.1 SW3.2 SW4.1 U1.6(DRVSS) U1.19(AVSS) U1.27(AVSS) U2.6(DRVSS) U2.19(AVSS) U2.27(AVSS) U3.19(TESTEN) U3.57(GND) U4.1(GND) U5.3(GND) U6.3(GND) U7.3(GND) U8.3(GND) U9.4(GND) U10.6(AGND) U10.10(AGND) U10.12(GND) U10.14(RESERVED) U10.26(GND) U10.28(GND) U10.41(GND) U10.53(GND) U10.56(GND) U11.2(A1) U11.3(A2) U11.4(VSS) U11.7(WP) USB1.A1(GND) USB1.A12(GND) USB1.B1(GND) USB1.B12(GND) USB2.A1(GND) USB2.A12(GND) USB2.B1(GND) USB2.B12(GND) X1.2(GND) X1.4(GND) X2.2(GND) X2.4(GND)
ADC1_ADCCLK: RN9.1 U1.3(ADCCLK)
ADC1_CAPB: C8.2 C9.1 C10.1 U1.20(CAPB)
ADC1_CAPT: C7.1 C8.1 C9.2 U1.21(CAPT)
ADC1_CDSCLK1: RN9.3 U1.1(CDSCLK1)
ADC1_CDSCLK2: RN9.2 U1.2(CDSCLK2)
ADC1_CML: C6.1 U1.23(CML)
ADC1_D0: RN2.4 U10.45(PD0/FD8)
ADC1_D1: RN2.3 U10.46(PD1/FD9)
ADC1_D2: RN2.2 U10.47(PD2/FD10)
ADC1_D3: RN2.1 U10.48(PD3/FD11)
ADC1_D4: RN1.4 U10.49(PD4/FD12)
ADC1_D5: RN1.3 U10.50(PD5/FD13)
ADC1_D6: RN1.2 U10.51(PD6/FD14)
ADC1_D7: RN1.1 U10.52(PD7/FD15)
ADC1_OEB: R17.1 U1.4(OEB)
ADC1_OFFSET: C4.2 C5.2 U1.25(OFFSET)
ADC1_SCLK: RN7.3 U1.16(SCLK)
ADC1_SDATA: RN7.2 U1.15(SDATA)
ADC1_SLOAD: RN7.4 U1.17(SLOAD)
ADC2_ADCCLK: RN8.1 U2.3(ADCCLK)
ADC2_CAPB: C46.1 C47.1 C60.2 U2.20(CAPB)
ADC2_CAPT: C44.1 C46.2 C60.1 U2.21(CAPT)
ADC2_CDSCLK1: RN8.3 U2.1(CDSCLK1)
ADC2_CDSCLK2: RN8.2 U2.2(CDSCLK2)
ADC2_CML: C43.1 U2.23(CML)
ADC2_D0: RN4.4 U10.18(PB0/FD0)
ADC2_D1: RN4.3 U10.19(PB1/FD1)
ADC2_D2: RN4.2 U10.20(PB2/FD2)
ADC2_D3: RN4.1 U10.21(PB3/FD3)
ADC2_D4: RN3.4 U10.22(PB4/FD4)
ADC2_D5: RN3.3 U10.23(PB5/FD5)
ADC2_D6: RN3.2 U10.24(PB6/FD6)
ADC2_D7: RN3.1 U10.25(PB7/FD7)
ADC2_OEB: R22.1 U2.4(OEB)
ADC2_OFFSET: C2.2 C40.2 U2.25(OFFSET)
ADC2_SCLK: RN6.4 U2.16(SCLK)
ADC2_SDATA: RN6.3 U2.15(SDATA)
ADC2_SLOAD: RN7.1 U2.17(SLOAD)
CCD_1E: CCD1.14(1E) R13.1
CCD_1O: CCD1.9(1O) R7.1
CCD_2B: CCD1.6(2B) CCD1.17(2B) R11.1
CCD_2E: CCD1.15(2E) R10.1
CCD_2O: CCD1.8(2O) R6.1
CCD_CLK_1: RN5.2 U5.2(INA) U8.2(INA)
CCD_CLK_2: RN5.3 U5.4(INB) U7.4(INB)
CCD_CLK_2B: RN5.4 U7.2(INA)
CCD_CLK_CP: RN6.2 U6.2(INA)
CCD_CLK_RS: RN6.1 U6.4(INB)
CCD_CLK_SH: RN5.1 U8.4(INB)
CCD_CP: CCD1.4(CP) CCD1.19(CP) R9.1
CCD_OS1: C1.2 CCD1.1(OS1)
CCD_OS2: C39.2 CCD1.22(OS2)
CCD_RS: CCD1.5(RS) CCD1.18(RS) R8.1
CCD_SH: CCD1.12(SH) R12.1
FALSH_SCLK: U3.52(QSPI_SCLK) U9.6(CLK)
FIFO_IFCLK: R26.2 U10.13(IFCLK/PE0)
FIFO_PKTEND: R27.2 U10.39(PA6/PKTEND)
FIFO_SLCS: RN10.1 U10.40(PA7/FLAGD/SLCS#)
FIFO_SLWR: RN9.4 U10.2(RDY1/SLWR)
FIFO_USB_DM: U10.9(DMINUS) USB2.A7(D-) USB2.B7(D-)
FIFO_USB_DP: U10.8(DPLUS) USB2.A6(D+) USB2.B6(D+)
FLASH_CS: R14.1 R15.2 U3.56(QSPI_SS) U9.1(CS#)
FLASH_SD0: U3.53(QSPI_SD0) U9.5(DI)
FLASH_SD1: U3.55(QSPI_SD1) U9.2(DO)
FLASH_SD2: U3.54(QSPI_SD2) U9.3(IO2)
FLASH_SD3: U3.51(QSPI_SD3) U9.7(IO3)
RPI_USB_DM: R1.2 USB1.A7(D-) USB1.B7(D-)
RPI_USB_DP: R2.2 USB1.A6(D+) USB1.B6(D+)
USB_VBUS: R28.1 R36.1 USB1.A4(VBUS) USB1.A9(VBUS) USB1.B4(VBUS) USB1.B9(VBUS)
USB_VBUS2: R36.2 USB2.A4(VBUS) USB2.A9(VBUS) USB2.B4(VBUS) USB2.B9(VBUS)
$1N1: C1.1 U1.22(VINB)
$1N150: R6.2 U5.5(OUTB)
$1N155: R7.2 U5.7(OUTA)
$1N156: R11.2 U7.7(OUTA)
$1N157: R9.2 U6.7(OUTA)
$1N160: R8.2 U6.5(OUTB)
$1N161: R10.2 U7.5(OUTB)
$1N164: R12.2 U8.5(OUTB)
$1N182: R13.2 U8.7(OUTA)
$1N259: R21.2 U2.22(VINB)
$1N274: RN1.8 U1.7(/MSBD7)
$1N277: RN2.5 U1.14(/LSBD0)
$1N278: RN2.6 U1.13(D1)
$1N279: RN2.7 U1.12(D2)
$1N280: RN2.8 U1.11(D3)
$1N281: RN1.5 U1.10(D4)
$1N282: RN1.6 U1.9(D5)
$1N283: RN1.7 U1.8(D6)
$1N294: RN3.8 U2.7(/MSBD7)
$1N295: RN3.7 U2.8(D6)
$1N296: RN3.6 U2.9(D5)
$1N297: RN3.5 U2.10(D4)
$1N302: RN4.5 U2.14(/LSBD0)
$1N303: RN4.6 U2.13(D1)
$1N304: RN4.7 U2.12(D2)
$1N305: RN4.8 U2.11(D3)
$1N316: R16.2 U1.26(VINR)
$1N317: R24.2 U1.24(VING)
$1N321: R23.2 U2.26(VINR)
$1N322: C39.1 U2.24(VING)
$2N66: RN7.6 U3.13(GPIO10)
$2N67: RN7.7 U3.12(GPIO9)
$2N68: RN7.8 U3.11(GPIO8)
$2N73: R2.1 U3.47(USB_DP)
$2N75: R1.1 U3.46(USB_DM)
$2N79: C26.1 C27.1 C28.1 U3.23(DVDD) U3.45(VREG_VOUT) U3.50(DVDD)
$2N98: C53.2 R15.1 SW1.2
$2N103: C38.2 U3.20(XIN) X1.3(OSC2)
$2N104: C37.2 U3.21(XOUT) X1.1(OSC1)
$2N123: C54.2 R18.1 SW2.2
$2N125: R18.2 U3.26(RUN)
$2N126: R19.2 U3.24(SWCLK)
$2N127: R20.2 U3.25(SWD)
$2N128: H3.1 R20.1
$2N129: H3.3 R19.1
$2N146: RN7.5 U3.14(GPIO11)
$2N149: RN8.8 U3.15(GPIO12)
$2N150: RN8.7 U3.16(GPIO13)
$2N151: RN8.6 U3.17(GPIO14)
$2N152: RN8.5 U3.18(GPIO15)
$2N157: RN6.5 U3.9(GPIO7)
$2N158: RN6.6 U3.8(GPIO6)
$2N159: RN6.7 U3.7(GPIO5)
$2N166: RN6.8 U3.6(GPIO4)
$2N167: RN5.5 U3.5(GPIO3)
$2N168: RN5.6 U3.4(GPIO2)
$2N169: RN5.8 U3.2(GPIO0)
$2N170: RN5.7 U3.3(GPIO1)
$2N205: RN9.5 U3.30(GPIO19)
$2N206: RN9.6 U3.29(GPIO18)
$2N207: RN9.7 U3.28(GPIO17)
$2N208: RN9.8 U3.27(GPIO16)
$2N227: C64.1 R5.1 USB1.0
$2N228: RN10.5 U3.37(GPIO25)
$2N229: RN10.6 U3.36(GPIO24)
$2N230: RN10.7 U3.35(GPIO23)
$2N231: RN10.8 U3.34(GPIO22)
$2N246: R27.1 U3.32(GPIO21)
$2N247: R26.1 U3.31(GPIO20)
$2N248: H2.1 U3.41(GPIO29_ADC3)
$2N249: H2.3 U3.40(GPIO28_ADC2)
$2N250: H2.5 U3.39(GPIO27_ADC1)
$2N251: H2.7 U3.38(GPIO26_ADC0)
$2N252: H2.8 RN10.4
$2N253: H2.6 RN10.3
$2N254: H2.4 RN10.2
$2N260: R35.1 USB1.B5(CC2)
$2N261: R34.1 USB1.A5(CC1)
$2N274: H2.2 RN8.4
$3N17: C50.2 U10.4(XTALOUT) X2.1(OSC1)
$3N18: C49.2 U10.5(XTALIN) X2.3(OSC2)
$3N43: R30.1 U10.15(SCL) U11.6(SCL)
$3N76: R32.2 U10.44(WAKEUP)
$3N84: C52.1 R4.2 SW3.1 U10.42(RESET#)
$3N113: C65.1 R25.1 USB2.0
$3N117: R29.1 USB2.A5(CC1)
$3N118: R33.2 USB2.B5(CC2)
$3N119: R37.1 U10.37(PA4/FIFOADR0) U10.38(PA5/FIFOADR1)
Net-(R3-2): R3.2 SW4.2 U11.1(A0)
Net-(R31-1): R31.1 U10.16(SDA) U11.5(SDA)

Not connected (* = marked no-connect by the designer): U4 4(VOUT)*; U5 1(ENA)* 8(ENB)*; U6 1(ENA)* 8(ENB)*; U7 1(ENA)* 8(ENB)*; U8 1(ENA)* 8(ENB)*; U10 1(RDY0/SLRD)* 29(CTL0/FLAGA)* 30(CTL1/FLAGB)* 31(CTL2/FLAGC)* 33(PA0/INT0#)* 34(PA1/INT1#)* 35(PA2/SLOE)* 36(PA3/WU2)* 54(CLKOUT/PE1)* 57(EP)*

## Notes on the sheets
sheet 1
- Copyright - 2026 mr258876
  This source describes Open Hardware and is licensed under CERN-OHL-W-2.0.
  You may modify and redistribute this source under the terms of the CERN Open
  Hardware Licence, weakly reciprocal, version 2.0 or any later version.
  This source is provided WITHOUT ANY EXPRESS OR IMPLIED WARRANTY,
  INCLUDING OF MERCHANTABILITY, SATISFACTORY QUALITY AND FITNESS FOR A
  PARTICULAR PURPOSE. See https://cern-ohl.web.cern.ch for details.
  Source location: https://github.com/mr258876/PRISM Film Scanner
- IMPORTANT NOTICE:
  This project is in early development. Schematic may change without notice.
  Power design & layout is not yet optmized. Noise may affect image quality dramatically.
- Project PRISM Film Scanner
- Version: 0  Proof of Concept
  Date: Mar 7, 2026    Author: mr258876
  Source: https://github.com/mr258876/PRISM Film Scanner
- Page 1/4: Image sensor / AD converter
- Socket: DIP-22​ Spacing 400mil
  Nextron 100-224-100-1001-00 recommended
sheet 2
- Copyright - 2026 mr258876
  This source describes Open Hardware and is licensed under CERN-OHL-W-2.0.
  You may modify and redistribute this source under the terms of the CERN Open
  Hardware Licence, weakly reciprocal, version 2.0 or any later version.
  This source is provided WITHOUT ANY EXPRESS OR IMPLIED WARRANTY,
  INCLUDING OF MERCHANTABILITY, SATISFACTORY QUALITY AND FITNESS FOR A
  PARTICULAR PURPOSE. See https://cern-ohl.web.cern.ch for details.
  Source location: https://github.com/mr258876/PRISM Film Scanner
- IMPORTANT NOTICE:
  This project is in early development. Schematic may change without notice.
  Power design & layout is not yet optmized. Noise may affect image quality dramatically.
- Project PRISM Film Scanner
- Version: 0  Proof of Concept
  Date: Mar 7, 2026    Author: mr258876
  Source: https://github.com/mr258876/PRISM Film Scanner
- Page 2/4: Timing generator
sheet 3
- Copyright - 2026 mr258876
  This source describes Open Hardware and is licensed under CERN-OHL-W-2.0.
  You may modify and redistribute this source under the terms of the CERN Open
  Hardware Licence, weakly reciprocal, version 2.0 or any later version.
  This source is provided WITHOUT ANY EXPRESS OR IMPLIED WARRANTY,
  INCLUDING OF MERCHANTABILITY, SATISFACTORY QUALITY AND FITNESS FOR A
  PARTICULAR PURPOSE. See https://cern-ohl.web.cern.ch for details.
  Source location: https://github.com/mr258876/PRISM Film Scanner
- IMPORTANT NOTICE:
  This project is in early development. Schematic may change without notice.
  Power design & layout is not yet optmized. Noise may affect image quality dramatically.
- Project PRISM Film Scanner
- Version: 0  Proof of Concept
  Date: Mar 7, 2026    Author: mr258876
  Source: https://github.com/mr258876/PRISM Film Scanner
- Page 3/4: USB output buffer
sheet 4
- Copyright - 2026 mr258876
  This source describes Open Hardware and is licensed under CERN-OHL-W-2.0.
  You may modify and redistribute this source under the terms of the CERN Open
  Hardware Licence, weakly reciprocal, version 2.0 or any later version.
  This source is provided WITHOUT ANY EXPRESS OR IMPLIED WARRANTY,
  INCLUDING OF MERCHANTABILITY, SATISFACTORY QUALITY AND FITNESS FOR A
  PARTICULAR PURPOSE. See https://cern-ohl.web.cern.ch for details.
  Source location: https://github.com/mr258876/PRISM Film Scanner
- IMPORTANT NOTICE:
  This project is in early development. Schematic may change without notice.
  Power design & layout is not yet optmized. Noise may affect image quality dramatically.
- Project PRISM Film Scanner
- Version: 0  Proof of Concept
  Date: Mar 7, 2026    Author: mr258876
  Source: https://github.com/mr258876/PRISM Film Scanner
- Page 4/4: Power
